# EAGLE schematic ESP_NOW_uni_FULL (EAGLE 9.7.0)
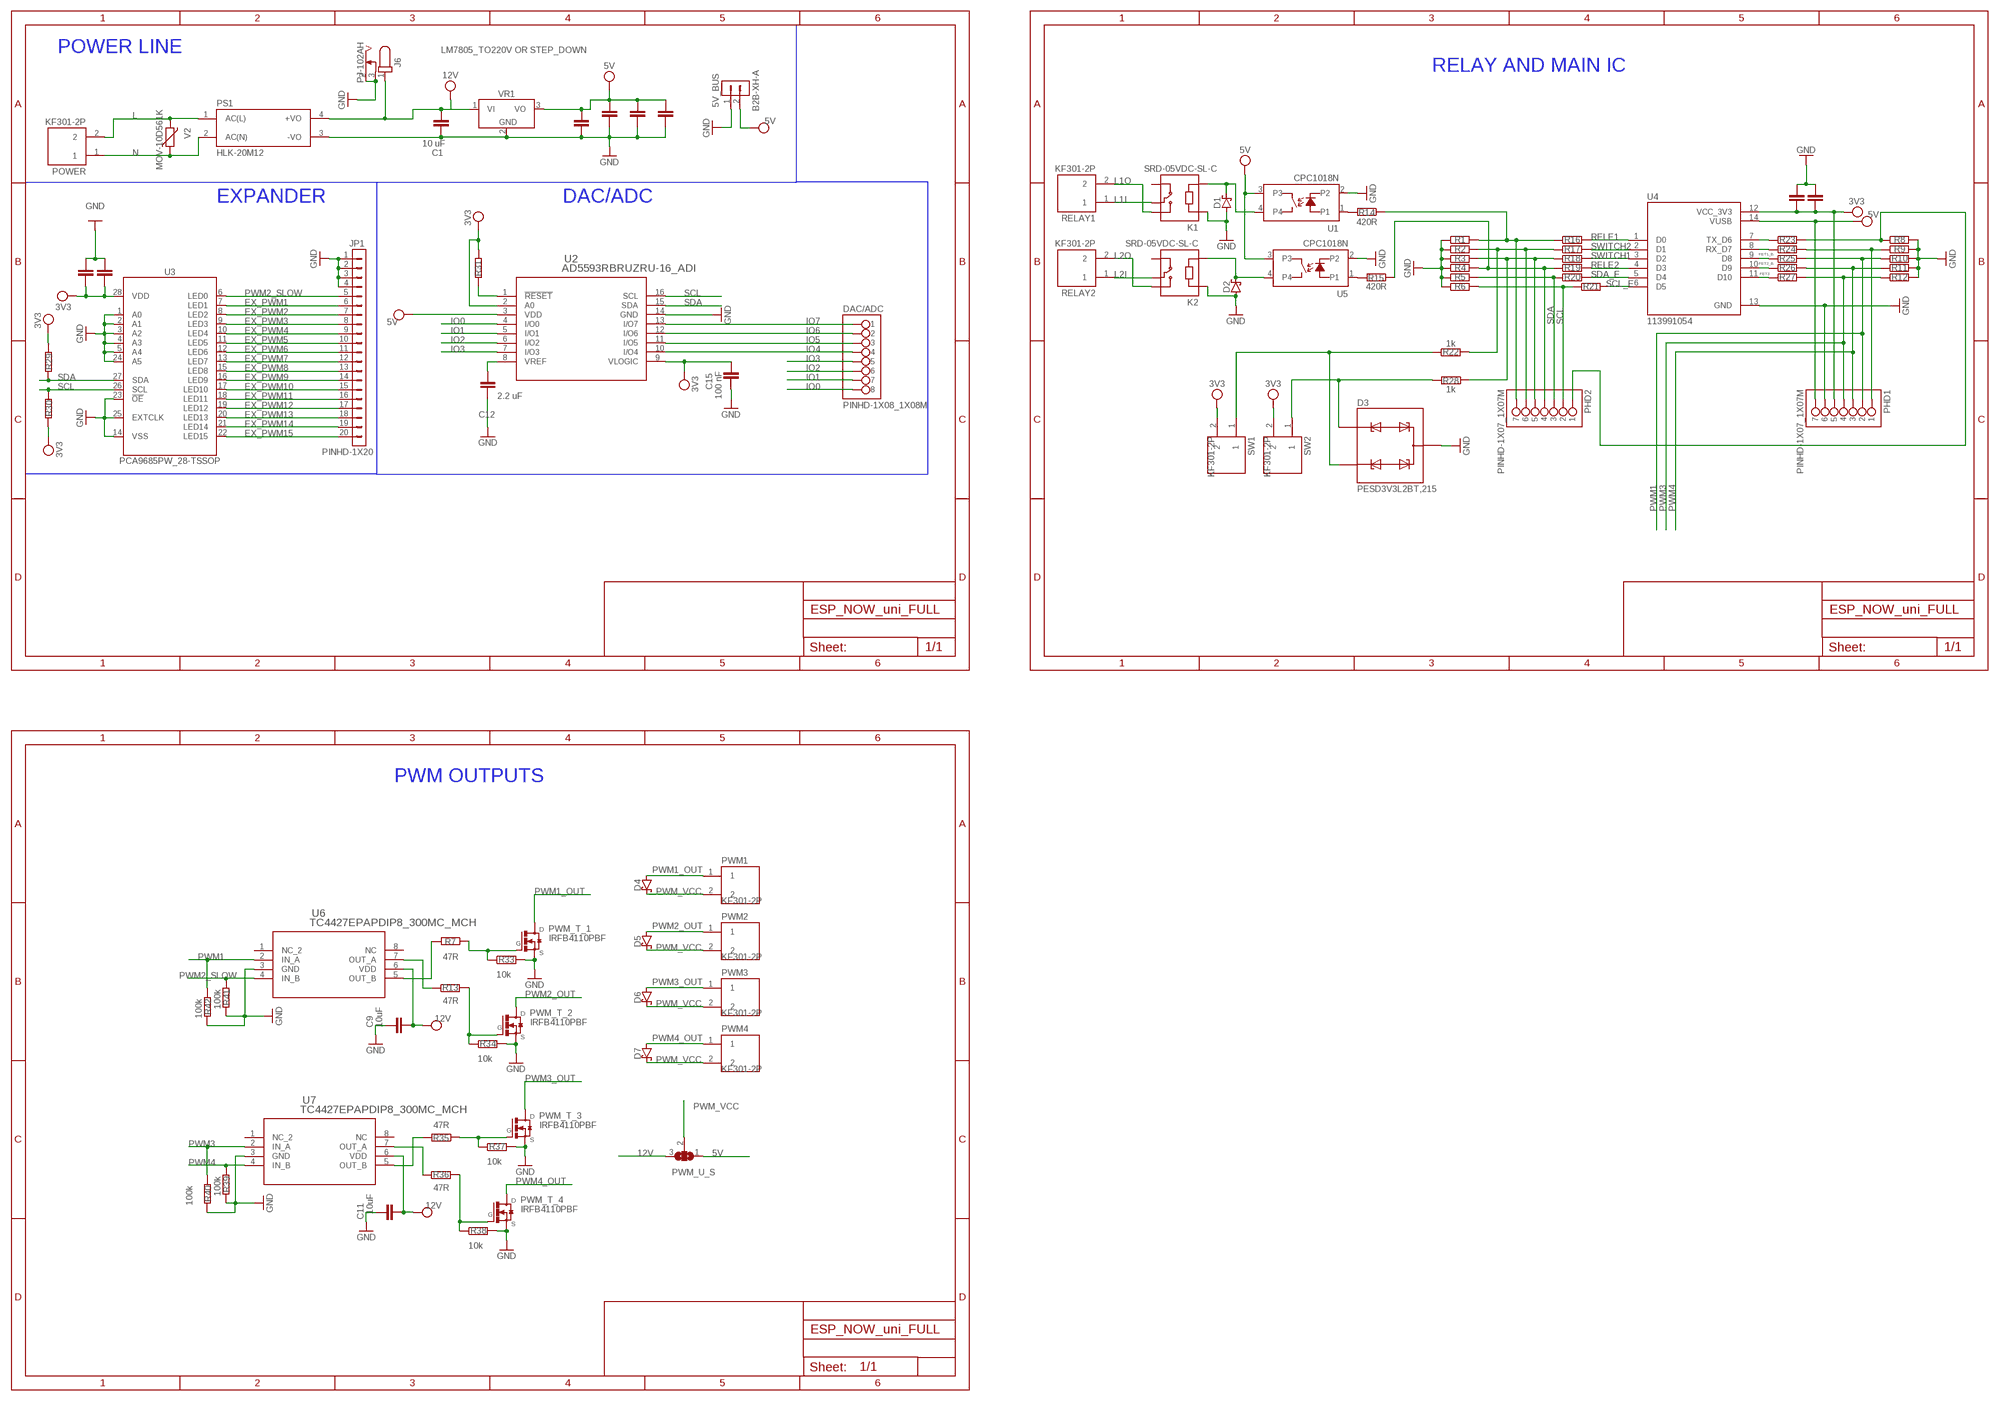
[diagram p0: schematic, sheet 1]

## Parts
5V_BUS  B2B-XH-A  [B2B-XH-A]
C1  10 uF  C_CHIP-0805(2012-METRIC)  [CAPC2012X110]
C2  0.1uF  C_CHIP-0805(2012-METRIC)  [CAPC2012X110]
C3  10uF  C_CHIP-0805(2012-METRIC)  [CAPC2012X110]
C4  10uF  C_CHIP-0805(2012-METRIC)  [CAPC2012X110]
C5  10uF  C_CHIP-0805(2012-METRIC)  [CAPC2012X110]
C6  10uF  C_CHIP-0805(2012-METRIC)  [CAPC2012X110]
C7  10uF  C_CHIP-0805(2012-METRIC)  [CAPC2012X110]
C8  10uF  C_CHIP-0805(2012-METRIC)  [CAPC2012X110]
C9  10uF  C_CHIP-0805(2012-METRIC)  [CAPC2012X110]
C10  10uF  C_CHIP-0805(2012-METRIC)  [CAPC2012X110]
C11  10uF  C_CHIP-0805(2012-METRIC)  [CAPC2012X110]
C12  2.2 uF  C_CHIP-0805(2012-METRIC)  [CAPC2012X110]
C15  100 nF  C_CHIP-0805(2012-METRIC)  [CAPC2012X110]
D1  SCHOTTKY_MBR0520LT1GDO-219  [SODFL3718X115]
D2  SCHOTTKY_MBR0520LT1GDO-219  [SODFL3718X115]
D3  PESD3V3L2BT,215  [SOT95P230X110-3N]
D4  SCHOTTKY_MBR0520LT1GDO-219  [SODFL3718X115]
D5  SCHOTTKY_MBR0520LT1GDO-219  [SODFL3718X115]
D6  SCHOTTKY_MBR0520LT1GDO-219  [SODFL3718X115]
D7  SCHOTTKY_MBR0520LT1GDO-219  [SODFL3718X115]
DAC/ADC  PINHD-1X08_1X08M  [1X08]
J6  PJ-102AH  [PJ-102AH]
JP1  PINHD-1X20  [1X20]
K1  SRD-05VDC-SL-C  [RELAY_SRD-05VDC-SL-C]
K2  SRD-05VDC-SL-C  [RELAY_SRD-05VDC-SL-C]
PHD1  PINHD-1X07_1X07M  [1X07]
PHD2  PINHD-1X07_1X07M  [1X07]
POWER  KF301-2P  [HANDSON_KF301-2P]
PS1  HLK-20M12  [CONV_HLK-20M12]
PWM1  KF301-2P  [HANDSON_KF301-2P]
PWM2  KF301-2P  [HANDSON_KF301-2P]
PWM3  KF301-2P  [HANDSON_KF301-2P]
PWM4  KF301-2P  [HANDSON_KF301-2P]
PWM_T_1  IRFB4110PBF  IRL540N  [TO220V]
PWM_T_2  IRFB4110PBF  IRL540N  [TO220V]
PWM_T_3  IRFB4110PBF  IRL540N  [TO220V]
PWM_T_4  IRFB4110PBF  IRL540N  [TO220V]
PWM_U_S  SJ2W  [SJ_2]
R1  R_CHIP-0603(1608-METRIC)  [RESC1608X60]
R2  R_CHIP-0603(1608-METRIC)  [RESC1608X60]
R3  R_CHIP-0603(1608-METRIC)  [RESC1608X60]
R4  R_CHIP-0603(1608-METRIC)  [RESC1608X60]
R5  R_CHIP-0603(1608-METRIC)  [RESC1608X60]
R6  R_CHIP-0603(1608-METRIC)  [RESC1608X60]
R7  47R  R_CHIP-0603(1608-METRIC)  [RESC1608X60]
R8  R_CHIP-0603(1608-METRIC)  [RESC1608X60]
R9  R_CHIP-0603(1608-METRIC)  [RESC1608X60]
R10  R_CHIP-0603(1608-METRIC)  [RESC1608X60]
R11  R_CHIP-0603(1608-METRIC)  [RESC1608X60]
R12  R_CHIP-0603(1608-METRIC)  [RESC1608X60]
R13  47R  R_CHIP-0603(1608-METRIC)  [RESC1608X60]
R14  420R  R_CHIP-0603(1608-METRIC)  [RESC1608X60]
R15  420R  R_CHIP-0603(1608-METRIC)  [RESC1608X60]
R16  R_CHIP-0603(1608-METRIC)  [RESC1608X60]
R17  R_CHIP-0603(1608-METRIC)  [RESC1608X60]
R18  R_CHIP-0603(1608-METRIC)  [RESC1608X60]
R19  R_CHIP-0603(1608-METRIC)  [RESC1608X60]
R20  R_CHIP-0603(1608-METRIC)  [RESC1608X60]
R21  R_CHIP-0603(1608-METRIC)  [RESC1608X60]
R22  1k  R_CHIP-0603(1608-METRIC)  [RESC1608X60]
R23  R_CHIP-0603(1608-METRIC)  [RESC1608X60]
R24  R_CHIP-0603(1608-METRIC)  [RESC1608X60]
R25  R_CHIP-0603(1608-METRIC)  [RESC1608X60]
R26  R_CHIP-0603(1608-METRIC)  [RESC1608X60]
R27  R_CHIP-0603(1608-METRIC)  [RESC1608X60]
R28  1k  R_CHIP-0603(1608-METRIC)  [RESC1608X60]
R29  R_CHIP-0603(1608-METRIC)  [RESC1608X60]
R30  R_CHIP-0603(1608-METRIC)  [RESC1608X60]
R31  R_CHIP-0603(1608-METRIC)  [RESC1608X60]
R33  10k  R_CHIP-0603(1608-METRIC)  [RESC1608X60]
R34  10k  R_CHIP-0603(1608-METRIC)  [RESC1608X60]
R35  47R  R_CHIP-0603(1608-METRIC)  [RESC1608X60]
R36  47R  R_CHIP-0603(1608-METRIC)  [RESC1608X60]
R37  10k  R_CHIP-0603(1608-METRIC)  [RESC1608X60]
R38  10k  R_CHIP-0603(1608-METRIC)  [RESC1608X60]
R39  100k  R_CHIP-0603(1608-METRIC)  [RESC1608X60]
R40  100k  R_CHIP-0603(1608-METRIC)  [RESC1608X60]
R41  100k  R_CHIP-0603(1608-METRIC)  [RESC1608X60]
R42  100k  R_CHIP-0603(1608-METRIC)  [RESC1608X60]
RELAY1  KF301-2P  [HANDSON_KF301-2P]
RELAY2  KF301-2P  [HANDSON_KF301-2P]
SW1  KF301-2P  [HANDSON_KF301-2P]
SW2  KF301-2P  [HANDSON_KF301-2P]
U1  CPC1018N  [CLARE_SO4]
U2  AD5593RBRUZRU-16_ADI  [RU-16_ADI]
U3  PCA9685PW_28-TSSOP  [SOP65P640X110-28]
U4  113991054  [MODULE_113991054]
U5  CPC1018N  [CLARE_SO4]
U6  TC4427EPAPDIP8_300MC_MCH  [PDIP8_300MC_MCH]
U7  TC4427EPAPDIP8_300MC_MCH  [PDIP8_300MC_MCH]
V2  MOV-10D561K  [MOV-10D561]
VR1  LM7805_TO220V OR STEP_DOWN  LM7805_TO220V  [TO220V]

## Nets
3V3: C6.2 C7.2 C8.2 C10.2 C15.1 PHD1.5 R29.1 R30.2 R31.2 SW1.2 SW2.2 U2.2(A0) U2.9(VLOGIC) U3.28(VDD) U4.12(VCC_3V3)
5V: 5V_BUS.2 C2.1 C3.1 C4.1 C5.1 PHD1.7 PWM_U_S.1 U1.3 U2.3(VDD) U4.14(VUSB) U5.3 VR1.3(VO)
12V: C1.1 C9.1 C11.1 J6.1 PS1.4(+VO) PWM_U_S.3 U6.6(VDD) U7.6(VDD) VR1.1(VI)
EX_PWM1: JP1.6 U3.7(LED1)
EX_PWM2: JP1.7 U3.8(LED2)
EX_PWM3: JP1.8 U3.9(LED3)
EX_PWM4: JP1.9 U3.10(LED4)
EX_PWM5: JP1.10 U3.11(LED5)
EX_PWM6: JP1.11 U3.12(LED6)
EX_PWM7: JP1.12 U3.13(LED7)
EX_PWM8: JP1.13 U3.15(LED8)
EX_PWM9: JP1.14 U3.16(LED9)
EX_PWM10: JP1.15 U3.17(LED10)
EX_PWM11: JP1.16 U3.18(LED11)
EX_PWM12: JP1.17 U3.19(LED12)
EX_PWM13: JP1.18 U3.20(LED13)
EX_PWM14: JP1.19 U3.21(LED14)
EX_PWM15: JP1.20 U3.22(LED15)
FET1_B: R25.1 U4.9(D8)
FET2_B: R26.1 U4.10(D9)
FET3: R27.1 U4.11(D10)
GND: 5V_BUS.1 C1.2 C2.2 C3.2 C4.2 C5.2 C6.1 C7.1 C8.1 C9.2 C10.1 C11.2 C12.2 C15.2 D1.2(A) D2.2(A) D3.3(CC) J6.2 J6.3 JP1.1 JP1.2 JP1.3 JP1.4 K1.A1 K2.A1 PHD1.6 PS1.3(-VO) PWM_T_1.3(S) PWM_T_2.3(S) PWM_T_3.3(S) PWM_T_4.3(S) R1.1 R2.1 R3.1 R4.1 R5.1 R6.1 R8.2 R9.2 R10.2 R11.2 R12.2 R33.2 R34.2 R37.2 R38.2 R39.2 R40.2 R41.2 R42.2 U1.2 U2.14(GND) U3.1(A0) U3.2(A1) U3.3(A2) U3.4(A3) U3.5(A4) U3.14(VSS) U3.23(!OE) U3.24(A5) U3.25(EXTCLK) U4.13(GND) U5.2 U6.3(GND) U7.3(GND) VR1.2(GND)
IO0: DAC/ADC.8 U2.4(I/O0)
IO1: DAC/ADC.7 U2.5(I/O1)
IO2: DAC/ADC.6 U2.6(I/O2)
IO3: DAC/ADC.5 U2.7(I/O3)
IO4: DAC/ADC.4 U2.10(I/O4)
IO5: DAC/ADC.3 U2.11(I/O5)
IO6: DAC/ADC.2 U2.12(I/O6)
IO7: DAC/ADC.1 U2.13(I/O7)
L: POWER.2 PS1.1(AC(L)) V2.2
L1I: K1.COM RELAY1.1
L1O: K1.NO RELAY1.2
L2I: K2.COM RELAY2.1
L2O: K2.NO RELAY2.2
N: POWER.1 PS1.2(AC(N)) V2.1
N$1: PWM_T_1.1(G) R7.1 R33.1
N$2: D3.2(K2) R22.1 SW1.1
N$3: R23.1 U4.7(TX_D6)
N$4: R24.1 U4.8(RX_D7)
N$5: D3.1(K1) R28.2 SW2.1
N$6: C12.1 U2.8(VREF)
N$8: D2.1(C) K2.A2 U5.4
N$9: D1.1(C) K1.A2 U1.4
N$10: R31.1 U2.1(!RESET)
N$11: PWM_T_2.1(G) R13.2 R34.1
N$12: PWM_T_3.1(G) R35.1 R37.1
N$13: PHD1.1 R9.1 R24.2
N$14: PHD2.1 R8.1 R23.2
N$15: PWM_T_4.1(G) R36.2 R38.1
N$16: PHD2.4 R4.2 R15.1 R19.1
N$17: R7.2 U6.5(OUT_B)
N$18: R14.2 U1.1
N$19: R15.2 U5.1
N$20: R13.1 U6.7(OUT_A)
N$23: R36.1 U7.7(OUT_A)
N$24: R35.2 U7.5(OUT_B)
N$30: PHD2.7 R1.2 R14.1 R16.1
PWM1: PHD1.2 R10.1 R25.2 R42.1 U6.2(IN_A)
PWM1_OUT: D4.2(A) PWM1.1 PWM_T_1.2(D)
PWM2_OUT: D5.2(A) PWM2.1 PWM_T_2.2(D)
PWM2_SLOW: JP1.5 R41.1 U3.6(LED0) U6.4(IN_B)
PWM3: PHD1.4 R12.1 R27.2 R40.1 U7.2(IN_A)
PWM3_OUT: D6.2(A) PWM3.1 PWM_T_3.2(D)
PWM4: PHD1.3 R11.1 R26.2 R39.1 U7.4(IN_B)
PWM4_OUT: D7.2(A) PWM4.1 PWM_T_4.2(D)
PWM_VCC: D4.1(C) D5.1(C) D6.1(C) D7.1(C) PWM1.2 PWM2.2 PWM3.2 PWM4.2 PWM_U_S.2
RELE1: R16.2 U4.1(D0)
RELE2: R19.2 U4.4(D3)
SCL: PHD2.2 R6.2 R21.1 R30.1 U2.16(SCL) U3.26(SCL)
SCL_E: R21.2 U4.6(D5)
SDA: PHD2.3 R5.2 R20.1 R29.2 U2.15(SDA) U3.27(SDA)
SDA_E: R20.2 U4.5(D4)
SW1: PHD2.6 R2.2 R17.1 R22.2
SW2: PHD2.5 R3.2 R18.1 R28.1
SWITCH1: R18.2 U4.3(D2)
SWITCH2: R17.2 U4.2(D1)
Unconnected: K1.NC K2.NC U6.1(NC_2) U6.8(NC) U7.1(NC_2) U7.8(NC)

## Notes on the sheet
- POWER LINE
- RELAY AND MAIN IC
- EXPANDER | DAC/ADC
- PWM OUTPUTS

## Library data of the parts
5V_BUS = Connector:B2B-XH-A: XH Connector Top Entry - 2POS Reference: : Datasheet <http://www.jst-mfg.com/product/pdf/eng/eXH.pdf>; CATEGORY: Connectors; DATASHEET: https://www.jst-mfg.com/product/pdf/eng/eXH.pdf; DESCRIPTION: Connector Header Through Hole 2 position 0.098" (2.50mm); MANUFACTURER: JST Sales America Inc.; MPN: B2B-XH-A; OPERATING_TEMPERATURE: -25°C ~ 85°C; PACKAGE_SIZE: NA; PACKAGE_TYPE: Through Hole; PART_STATUS: Active; PITCH: 0.098" (2.50mm); ROHS: Compliant; SERIES: XH; SUBCATEGORY: Rectangular Connectors; TYPE: Male Headers
C1-C12 C15 = Capacitor:C: Capacitor - Generic; CATEGORY: Capacitor; PACKAGE_SIZE: 0805; PACKAGE_TYPE: SMD; SUBCATEGORY: Ceramic Capacitors; TYPE: MLCC
D1 D2 D4-D7 = Diode:SCHOTTKY_: Schottky Diode - Popular Parts; CATEGORY: Diode; DATASHEET: https://www.onsemi.com/download/data-sheet/pdf/mbr0520lt1-d.pdf; DESCRIPTION: Diode 20 V 500mA Surface Mount SOD-123; FORWARD_CURRENT: 500mA; FORWARD_VOLTAGE: 385mV; MANUFACTURER: onsemi; MPN: MBR0520LT1G; OPERATING_TEMPERATURE: -65°C ~ 125°C; PACKAGE_SIZE: SOD-123; PACKAGE_TYPE: Surface Mount; PART_STATUS: Active; REVERSE_VOLTAGE: 20V; ROHS: Compliant; SERIES: MBR0520; SUBCATEGORY: Schottky Diodes; TYPE: Schottky Power Rectifier; ZENER_VOLTAGE: NA
D3 = PESD3V3L2BT_215:PESD3V3L2BT,215: Check availability <https://pricing.snapeda.com/parts/PESD3V3L2BT%2C215/NXP%20Semiconductors/view-part?ref=eda>; AVAILABILITY: In Stock; CHECK_PRICES: https://www.snapeda.com/parts/PESD3V3L2BT,215/NXP+Semiconductors/view-part/?ref=eda; DESCRIPTION: PESDxL2BT Series 26 V 101 pF Low Capacitance ESD Protection Diode - SOT-23-3; MF: NXP Semiconductors; MP: PESD3V3L2BT,215; PACKAGE: SOT-23-3 NXP Semiconductors; PRICE: None; SNAPEDA_LINK: https://www.snapeda.com/parts/PESD3V3L2BT,215/NXP+Semiconductors/view-part/?ref=snap
DAC/ADC = Tinkercad:PINHD-1X08
J6 = Connector:PJ-102AH: 2.0 x 6.5 mm, 5.0 A, Horizontal, Through Hole, Tapered Pins, Dc Power Jack Connector; CATEGORY_L1: Connectors; CATEGORY_L2: Power Connectors; CATEGORY_L3: DC Jack Male; DATASHEET: https://www.sameskydevices.com/product/resource/pj-102ah.pdf; DESCRIPTION: Power Barrel Connector Jack 2.00mm ID (0.079") & 5.50mm OD (0.217") Through Hole & Right Angle; MANUFACTURER: Same Sky; MPN: PJ-102AH; OPERATING_TEMPERATURE: -25°C ~ 85°C; PACKAGE: Through Hole; PACKAGE_SIZE: NA; PART_STATUS: Active; PITCH: NA; ROHS: Compliant; SERIES: PJ-102
JP1 = Connector:PINHD-1X20: Pin Header; CATEGORY: Connectors; DESCRIPTION: Header-Straight-10 Position; PACKAGE_TYPE: Through Hole; PITCH: 0.100" (2.54mm); SUBCATEGORY: Headers; TYPE: Male Pins
K1 K2 = SRD-05VDC-SL-C:SRD-05VDC-SL-C: Check availability <https://pricing.snapeda.com/parts/SRD-05VDC-SL-C/Songle%20Relay/view-part?ref=eda>; AVAILABILITY: In Stock; CHECK_PRICES: https://www.snapeda.com/parts/SRD-05VDC-SL-C/Songle+Relay/view-part/?ref=eda; DESCRIPTION: 5V Trigger Relay Module For Arduino And Raspberry Pi 5V Trigger Relay Module For Arduino And Raspberry Pi; MF: Songle Relay; MP: SRD-05VDC-SL-C; PACKAGE: NON STANDARD-5 Songle Relay; PRICE: None; SNAPEDA_LINK: https://www.snapeda.com/parts/SRD-05VDC-SL-C/Songle+Relay/view-part/?ref=snap
PHD1 PHD2 = Tinkercad:PINHD-1X07
POWER PWM1-PWM4 RELAY1 RELAY2 SW1 SW2 = KF301-2P:KF301-2P: Check availability <https://pricing.snapeda.com/parts/KF301-2P/Handson%20Technology/view-part?ref=eda>; AVAILABILITY: Not in stock; CHECK_PRICES: https://www.snapeda.com/parts/KF301-2P/Handson+Technology/view-part/?ref=eda; DESCRIPTION: 2 Pin Terminal Block 5mm Pitch; MF: Handson Technology; MP: KF301-2P; PACKAGE: None; PRICE: None; SNAPEDA_LINK: https://www.snapeda.com/parts/KF301-2P/Handson+Technology/view-part/?ref=snap
PS1 = HLK-20M12:HLK-20M12: Check availability <https://pricing.snapeda.com/parts/HLK-20M12/Hi-link/view-part?ref=eda>; AVAILABILITY: Not in stock; CHECK_PRICES: https://www.snapeda.com/parts/HLK-20M12/Hi-link/view-part/?ref=eda; DESCRIPTION: 20W ultra-small series module power supply; MF: Hi-link; MP: HLK-20M12; PACKAGE: Non-Standard Hi-link; PRICE: None; SNAPEDA_LINK: https://www.snapeda.com/parts/HLK-20M12/Hi-link/view-part/?ref=snap
PWM_T_1-PWM_T_4 = IRL540N:IRL540N: Check availability <https://pricing.snapeda.com/parts/IRL540N/Infineon%20Technologies/view-part?ref=eda>; AVAILABILITY: In Stock; CHECK_PRICES: https://www.snapeda.com/parts/IRL540N/Infineon/view-part/?ref=eda; DESCRIPTION: N-Channel 100 V 36A (Tc) 3.8W (Ta), 140W (Tc) Surface Mount D2PAK; MF: Infineon Technologies; MP: IRL540N; PACKAGE: TO-220 Infineon; PRICE: None; PURCHASE-URL: https://www.snapeda.com/api/url_track_click_mouser/?unipart_id=2773806&manufacturer=Infineon Technologies&part_name=IRL540N&search_term=None; SNAPEDA_LINK: https://www.snapeda.com/parts/IRL540N/Infineon/view-part/?ref=snap
PWM_U_S = jumper:SJ2W: SMD solder JUMPER
R1-R31 R33-R42 = Resistor:R: Resistor Fixed - Generic; CATEGORY: Resistors; DESCRIPTION: Chip Resistor 1.60 X 0.82 X 0.60 mm body 0603(1608-METRIC) Package; PACKAGE_SIZE: 0603; PACKAGE_TYPE: SMD
U1 U5 = CPC1018N:CPC1018N: Check availability <https://pricing.snapeda.com/parts/CPC1018N/IXYS%20Integrated%20Circuits/view-part?ref=eda>; AVAILABILITY: In Stock; CHECK_PRICES: https://www.snapeda.com/parts/CPC1018N/IXYS/view-part/?ref=eda; DESCRIPTION: Solid State Photo-Coupled Relay (Photorelay) SPST-NO (1 Form A) 4-SOP (0.150, 3.81mm); MF: IXYS Integrated Circuits; MP: CPC1018N; PACKAGE: SOP-4 Ixys Corporation; PRICE: None; SNAPEDA_LINK: https://www.snapeda.com/parts/CPC1018N/IXYS/view-part/?ref=snap
U2 = 2026-07-31_06-15-37_Library:AD5593RBRUZ; COPYRIGHT: Copyright (C) 2026 Ultra Librarian. All rights reserved.; DATASHEET: https://www.analog.com/media/en/technical-documentation/data-sheets/AD5593R.pdf; DESCRIPTION: 8-Channel, 12-Bit, Configurable ADC/DAC with On-Chip Reference, I2C Interface; MANUFACTURER_NAME: Analog Devices Inc; MANUFACTURER_PART_NUMBER: AD5593RBRUZ
U3 = IC_Power-Management:PCA9685PW: LED Driver IC 16 Output; CATEGORY: Power Management IC; DATASHEET: https://www.nxp.com/docs/en/data-sheet/PCA9685.pdf; DESCRIPTION: LED Driver IC 16 Output Linear PWM Dimming 25mA 28-TSSOP; INPUT_VOLTAGE: 2.3V ~ 5.5V; MANUFACTURER: NXP USA Inc.; MPN: PCA9685PW118; OPERATING_TEMPERATURE: -40°C ~ 85°C; OUTPUT_CURRENT: 25mA; OUTPUT_VOLTAGE: 5.5V; PACKAGE_SIZE: 28-TSSOP; PACKAGE_TYPE: Surface Mount; PART_STATUS: Active; ROHS: Compliant; SERIES: PCA9685; SUBCATEGORY: LED Drivers; THERMALLOSS: 0.4 W; TOPOLOGY: NA; TYPE: Linear
U4 = esp32c3_seeed:113991054: Check availability <https://pricing.snapeda.com/parts/113991054/Seeed%20Technology%20Co.%2C%20Ltd/view-part?ref=eda>; AVAILABILITY: In Stock; CHECK_PRICES: https://www.snapeda.com/parts/113991054/Seeed+Studio/view-part/?ref=eda; DESCRIPTION: - ESP32-C3 Transceiver; 802.11 a/b/g/n (Wi-Fi, WiFi, WLAN), Bluetooth® Smart 4.x Low Energy (BLE) 2.4GHz Evaluation Board; MF: Seeed Technology Co., Ltd; MP: 113991054; PACKAGE: None; PRICE: None; SNAPEDA_LINK: https://www.snapeda.com/parts/113991054/Seeed+Studio/view-part/?ref=snap
U6 U7 = 2026-03-07_17-24-57_Library:TC4427EPA; COPYRIGHT: Copyright (C) 2026 Ultra Librarian. All rights reserved.; MANUFACTURER_NAME: Microchip; MANUFACTURER_PART_NUMBER: TC4427EPA
V2 = MOV-10D561K:MOV-10D561K: Check availability <https://pricing.snapeda.com/parts/MOV-10D561K/Bourns/view-part?ref=eda>; AVAILABILITY: In Stock; CHECK_PRICES: https://www.snapeda.com/parts/MOV-10D561K/Bourns/view-part/?ref=eda; DESCRIPTION: 560 V 2.5 kA Varistor 1 Circuit Through Hole Disc 10mm; MF: Bourns; MP: MOV-10D561K; PACKAGE: Disc-10 Bourns; PRICE: None; SNAPEDA_LINK: https://www.snapeda.com/parts/MOV-10D561K/Bourns/view-part/?ref=snap
VR1 = IC_Power-Management:LM7805: 5V Voltage Regulator Reference Datasheet <https://www.ti.com/lit/ds/symlink/lm340.pdf>; CATEGORY: Power Management IC; DESCRIPTION: Linear Voltage Regulator IC TO-220; PACKAGE_SIZE: TO-220; PACKAGE_TYPE: THT; SERIES: LM7805; SUBCATEGORY: Voltage Regulators; TYPE: Linear & LDO Regulators